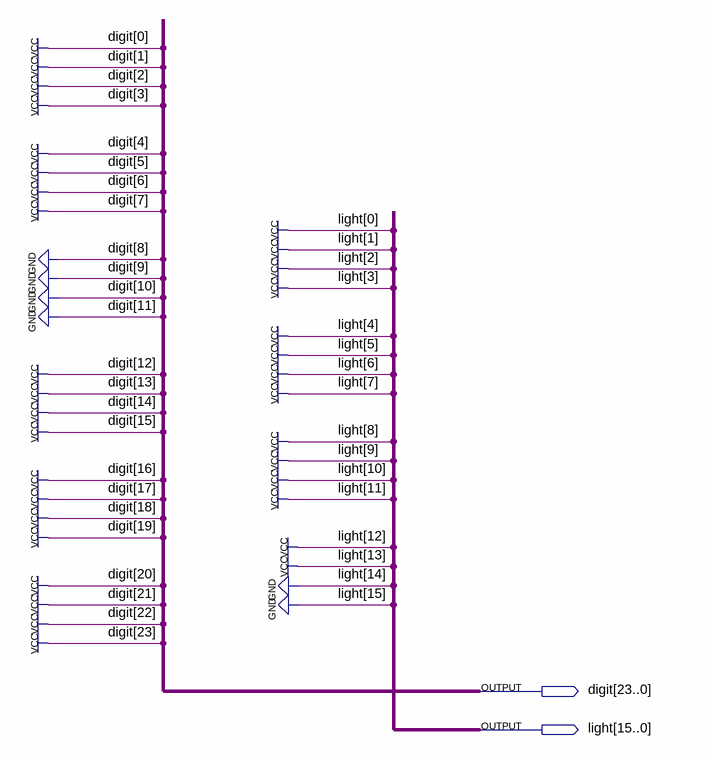
[diagram p0: schematic sheet]
// Quartus schematic Pattern_6_Frame_14.bdf as structural Verilog: 0 symbols, 2 pins
module Pattern_6_Frame_14 (
  output [23:0] digit,
  output [15:0] light
);


  assign digit = 24'b111111111111000011111111;
  assign light = 16'b0011111111111111;
endmodule
